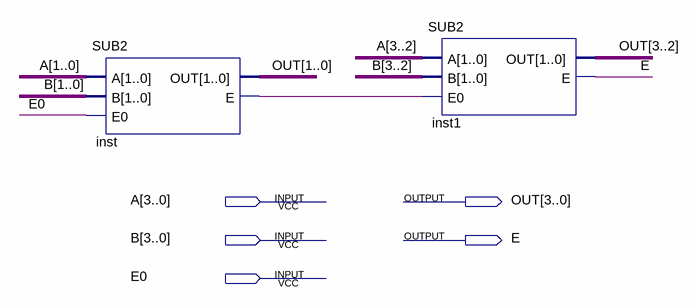
[diagram p0: schematic sheet]
// Quartus schematic SUB4.bdf as structural Verilog: 2 symbols, 5 pins
module SUB4 (
  input  [3:0] A,
  input  [3:0] B,
  input  E0,
  output [3:0] OUT,
  output E
);

  wire inst_e;

  SUB2 inst (.A(A[1:0]), .B(B[1:0]), .E0(E0), .OUT(OUT[1:0]), .E(inst_e));
  SUB2 inst1 (.A(A[3:2]), .B(B[3:2]), .E0(inst_e), .OUT(OUT[3:2]), .E(E));
endmodule
